# Altium schematic sheet 02 MCU电源.SchDoc
size A4
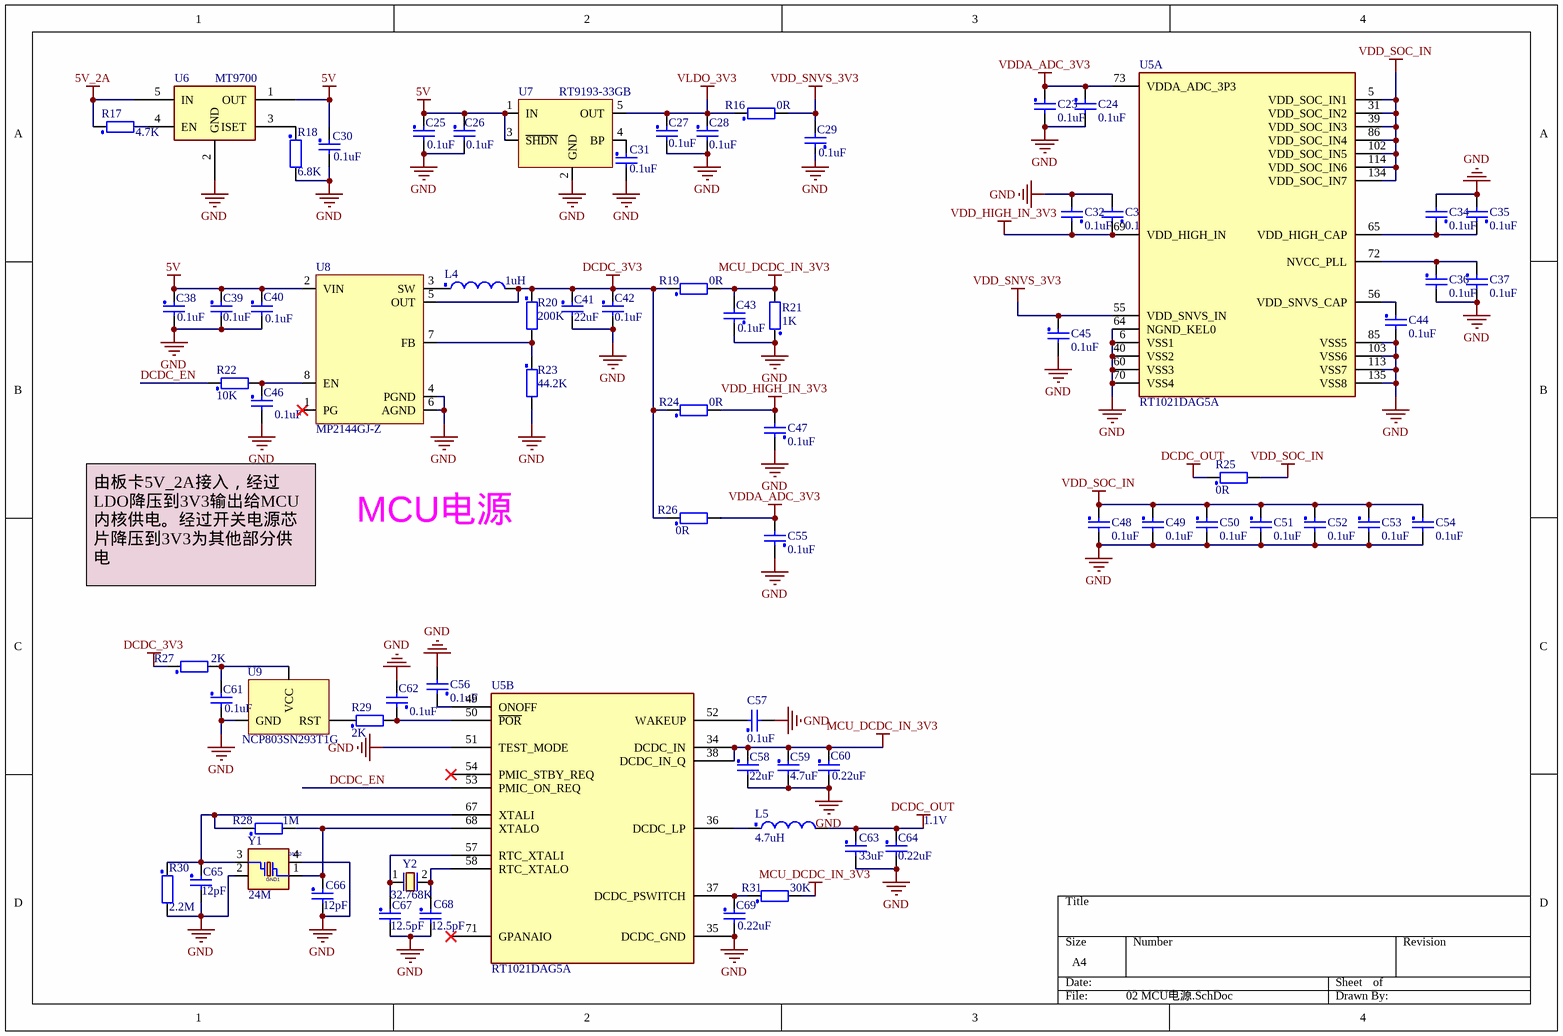
[diagram p0: 02 MCU电源.SchDoc]

## Parts
C23  0.1uF  [cap0603]
C24  0.1uF  [cap0603]
C25  0.1uF  [cap0603]
C26  0.1uF  [cap0603]
C27  0.1uF  [cap0603]
C28  0.1uF  [cap0603]
C29  0.1uF  [cap0603]
C30  0.1uF  [cap0603]
C31  0.1uF  [cap0603]
C32  0.1uF  [cap0603]
C33  0.1uF  [cap0603]
C34  0.1uF  [cap0603]
C35  0.1uF  [cap0603]
C36  0.1uF  [cap0603]
C37  0.1uF  [cap0603]
C38  0.1uF  [cap0603]
C39  0.1uF  [cap0603]
C40  0.1uF  [cap0603]
C41  22uF  [CASE-A_3216]
C42  0.1uF  [cap0603]
C43  0.1uF  [cap0603]
C44  0.1uF  [cap0603]
C45  0.1uF  [cap0603]
C46  0.1uF  [cap0603]
C47  0.1uF  [cap0603]
C48  0.1uF  [cap0603]
C49  0.1uF  [cap0603]
C50  0.1uF  [cap0603]
C51  0.1uF  [cap0603]
C52  0.1uF  [cap0603]
C53  0.1uF  [cap0603]
C54  0.1uF  [cap0603]
C55  0.1uF  [cap0603]
C56  0.1uF  [cap0603]
C57  0.1uF  [cap0603]
C58  22uF  [CASE-A_3216]
C59  4.7uF  [cap0603]
C60  0.22uF  [cap0603]
C61  0.1uF  [cap0603]
C62  0.1uF  [cap0603]
C63  33uF  [CASE-A_3216]
C64  0.22uF  [cap0603]
C65  12pF  [cap0603]
C66  12pF  [cap0603]
C67  12.5pF  [cap0603]
C68  12.5pF  [cap0603]
C69  0.22uF  [cap0603]
L4  1uH  [CD43]
L5  4.7uH  [CD43]
R16  0R  [res0603]
R17  4.7K  [res0603]
R18  6.8K  [res0603]
R19  0R  [res0603]
R20  200K  [res0603]
R21  1K  [res0603]
R22  10K  [res0603]
R23  44.2K  [res0603]
R24  0R  [res0603]
R25  0R  [res0603]
R26  0R  [res0603]
R27  2K  [res0603]
R28  1M  [res0603]
R29  2K  [res0603]
R30  2.2M  [res0603]
R31  30K  [res0603]
U5  RT1021DAG5A  [LQFP144]  (parts A,B of 6)
U6  MT9700  [SOT23-5]
U7  RT9193-33GB  [SOT23-5]
U8  MP2144GJ-Z  [TSOT23-8]
U9  NCP803SN293T1G  [SOT-23-3]
Y1  value 24M  [SMD3225]  (hidden comment: 24MHz)
Y2  32.768K  [SMD3215]

## Nets
5V: C25.1 C26.1 C30.1 C38.1 C39.1 C40.1 U6.1(OUT) U7.1(IN) U7.3(~{SHDN}) U8.2(VIN)
5V_2A: R17.1 U6.5(IN)
DCDC_3V3: C41.1 C42.1 L4.2 R19.1 R20.1 R24.1 R26.1 R27.1 U8.5(OUT)
DCDC_OUT: C63.1 C64.1 L5.2 R25.1
GND: C23.2 C24.2 C25.2 C26.2 C27.2 C28.2 C29.1 C30.2 C31.2 C32.2 C33.2 C34.2 C35.2 C36.2 C37.2 C38.2 C39.2 C40.2 C41.2 C42.2 C43.1 C44.2 C45.2 C46.2 C47.1 C48.2 C49.2 C50.2 C51.2 C52.2 C53.2 C54.2 C55.1 C56.2 C57.2 C58.2 C59.2 C60.2 C61.2 C62.2 C63.2 C64.2 C65.2 C66.2 C67.2 C68.2 C69.2 R18.2 R21.1 R23.2 R30.2 U5.6(VSS1) U5.35(DCDC_GND) U5.40(VSS2) U5.51(TEST_MODE) U5.60(VSS3) U5.64(NGND_KEL0) U5.70(VSS4) U5.85(VSS5) U5.103(VSS6) U5.113(VSS7) U5.135(VSS8) U6.2(GND) U7.2(GND) U8.4(PGND) U8.6(AGND) U9.1(GND) Y1.2(GND1) Y1.4(GND2)
MCU_DCDC_IN_3V3: C43.2 C58.1 C59.1 C60.1 R19.2 R21.2 R31.2 U5.34(DCDC_IN) U5.38(DCDC_IN_Q)
VDD_HIGH_IN_3V3: C32.1 C33.1 C47.2 R24.2 U5.69(VDD_HIGH_IN)
VDD_SNVS_3V3: C29.2 C45.1 R16.2 U5.55(VDD_SNVS_IN)
VDD_SOC_IN: C48.1 C49.1 C50.1 C51.1 C52.1 C53.1 C54.1 R25.2 U5.5(VDD_SOC_IN1) U5.31(VDD_SOC_IN2) U5.39(VDD_SOC_IN3) U5.86(VDD_SOC_IN4) U5.102(VDD_SOC_IN5) U5.114(VDD_SOC_IN6) U5.134(VDD_SOC_IN7)
VDDA_ADC_3V3: C23.1 C24.1 C55.2 R26.2 U5.73(VDDA_ADC_3P3)
VLDO_3V3: C27.1 C28.1 R16.1 U7.5(OUT)
DCDC_EN: R22.1 U5.53(PMIC_ON_REQ)
NetC31_1: C31.1 U7.4(BP)
NetC34_1: C34.1 C35.1 U5.65(VDD_HIGH_CAP)
NetC36_1: C36.1 C37.1 U5.72(NVCC_PLL)
NetC44_1: C44.1 U5.56(VDD_SNVS_CAP)
NetC46_1: C46.1 R22.2 U8.8(EN)
NetC56_1: C56.1 U5.49(ONOFF)
NetC57_1: C57.1 U5.52(WAKEUP)
NetC61_1: C61.1 R27.2 U9.3(VCC)
NetC62_1: C62.1 R29.2 U5.50(~{POR})
NetC65_1: C65.1 R28.1 R30.1 U5.67(XTALI) Y1.3
NetC66_1: C66.1 R28.2 U5.68(XTALO) Y1.1
NetC67_1: C67.1 U5.57(RTC_XTALI) Y2.1
NetC68_1: C68.1 U5.58(RTC_XTALO) Y2.2
NetC69_1: C69.1 R31.1 U5.37(DCDC_PSWITCH)
NetL4_1: L4.1 U8.3(SW)
NetL5_1: L5.1 U5.36(DCDC_LP)
NetR17_2: R17.2 U6.4(EN)
NetR18_1: R18.1 U6.3(ISET)
NetR20_2: R20.2 R23.1 U8.7(FB)
NetR29_1: R29.1 U9.2(RST)

Not connected (* = marked no-connect by the designer): U5 54(PMIC_STBY_REQ)* 71(GPANAIO)*; U8 1(PG)*

## Notes on the sheet
- 由板卡5V_2A接入，经过LDO降压到3V3输出给MCU内核供电。经过开关电源芯片降压到3V3为其他部分供电
- MCU电源
- (near C64) 1.1V

## Library data of the parts
C23-C40 C42-C57 C59-C62 C64-C69 = Cap: 贴片电容; Published: 8-Jun-2000; LatestRevisionDate: 17-Jul-2002; LatestRevisionNote: Re-released for DXP Platform.; PackageReference: RAD-0.3; Publisher: Altium Limited
  C23-C40 C42-C57 C61 C62: Value: 0.1uF
  C59: Value: 4.7uF
  C60 C64 C69: Value: 0.22uF
  C65 C66: Value: 12pF
  C67 C68: Value: 12.5pF
C41 C58 C63 = Cap: 钽电容; Published: 8-Jun-2000; LatestRevisionDate: 17-Jul-2002; LatestRevisionNote: Re-released for DXP Platform.; PackageReference: RAD-0.3; Publisher: Altium Limited
  C41 C58: Value: 22uF
  C63: Value: 33uF
L4 L5 = Inductor: 贴片功率电感; Code_IEC: 1005; Published: 8-Jun-2000; LatestRevisionDate: 17-Jul-2002; LatestRevisionNote: Re-released for DXP Platform.; PackageReference: 0402-A; Publisher: Altium Limited; Code_JEITA: 0402
  L4: Value: 1uH
  L5: Value: 4.7uH
R16-R31 = Res: 贴片电阻; Published: 8-Jun-2000; LatestRevisionDate: 17-Jul-2002; LatestRevisionNote: Re-released for DXP Platform.; PackageReference: AXIAL-0.4; Publisher: Altium Limited
  R16 R19 R24-R26: Value: 0R
  R17: Value: 4.7K
  R18: Value: 6.8K
  R20: Value: 200K
  R21: Value: 1K
  R22: Value: 10K
  R23: Value: 44.2K
  R27 R29: Value: 2K
  R28: Value: 1M
  R30: Value: 2.2M
  R31: Value: 30K
U5 = RT1021DAG5A: Cortex-M7 500MHZ 1.3V; ASSY_OPT: *; CLASS: *; SPLIT_INST: *; SWAP_INFO: *; AGILE_PN: *; MFG_NAME01: *; MFG_PN01: *; ROHS: *; Temp_Range: *; PRE_APN: *; CAD_APPROVED: *; HEIGHT: *; SILK: *
U6 = MT9700: 功率开关，SY6280AAC
U7 = RT9193-33GB: 线性稳压芯片3.3V  300mA  SOT23-5; CLASS: *; AGILE_PN: *; MFG_NAME01: *; MFG_PN01: *; ROHS: *; PRE_APN: *; ASSY_OPT: *; CAD_APPROVED: *; HEIGHT: *; SILK: *
U8 = MP2144GJ-Z: 开关稳压芯片 0.6V 2A 2.5-5.5V TSOT23-8; CLASS: *; Temp_Range: *; SILK: *; HEIGHT: *; CAD_APPROVED: *; ASSY_OPT: *; PRE_APN: *; ROHS: *; MFG_PN01: *; MFG_NAME01: *; AGILE_PN: *
U9 = NCP803SN293T1G: mcu复位芯片
Y1 = CRYSTAL_JXS63: 无源晶振24MHZ 12pF 3.2X2.5MM SMD; CLASS: *; HEIGHT: *; CAD_APPROVED: *; ASSY_OPT: *; PRE_APN: *; ICA_MFR_NAME: *; ICA_PARTNUM: *; ROHS: *; MFG_PN01: *; MFG_NAME01: *; AGILE_PN: *; Temp_Range: *
Y2 = CRYSTAL: 晶振 32.768KHZ 12.5PF; CLASS: *; SILK: *; HEIGHT: *; CAD_APPROVED: *; ASSY_OPT: *; PRE_APN: *; ROHS: *; MFG_PN01: *; MFG_NAME01: *; AGILE_PN: *